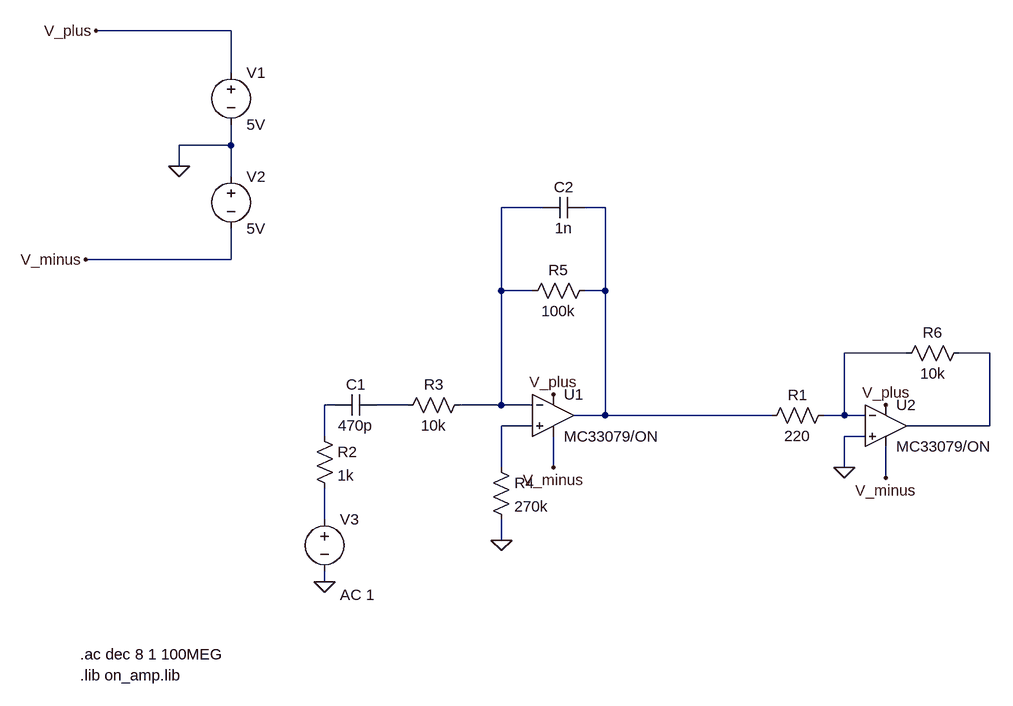
[diagram p0: schematic opamp_test.asc]
opamp_test.asc, the LTspice schematic file:
Version 4
SHEET 1 920 840
WIRE -1024 -448 -1232 -448
WIRE -1024 -384 -1024 -448
WIRE -1024 -272 -1024 -304
WIRE -1024 -272 -1104 -272
WIRE -1104 -240 -1104 -272
WIRE -1024 -224 -1024 -272
WIRE -544 -176 -608 -176
WIRE -448 -176 -480 -176
WIRE -1024 -96 -1024 -144
WIRE -1024 -96 -1248 -96
WIRE -608 -48 -608 -176
WIRE -560 -48 -608 -48
WIRE -448 -48 -448 -176
WIRE -448 -48 -480 -48
WIRE 16 48 -80 48
WIRE 144 48 96 48
WIRE -864 128 -880 128
WIRE -752 128 -800 128
WIRE -608 128 -608 -48
WIRE -608 128 -672 128
WIRE -560 128 -608 128
WIRE -448 144 -448 -48
WIRE -448 144 -496 144
WIRE -192 144 -448 144
WIRE -80 144 -80 48
WIRE -80 144 -112 144
WIRE -48 144 -80 144
WIRE -560 160 -608 160
WIRE 144 160 144 48
WIRE 144 160 16 160
WIRE -880 176 -880 128
WIRE -48 176 -80 176
WIRE -608 224 -608 160
WIRE -528 224 -528 176
WIRE -80 224 -80 176
WIRE -16 240 -16 192
WIRE -880 304 -880 256
WIRE -608 336 -608 304
WIRE -880 400 -880 384
FLAG -1104 -240 0
FLAG -1232 -448 V_plus
FLAG -1248 -96 V_minus
FLAG -528 224 V_minus
FLAG -528 112 V_plus
FLAG -880 400 0
FLAG -608 336 0
FLAG -16 240 V_minus
FLAG -16 128 V_plus
FLAG -80 224 0
SYMBOL Opamps\\opamp2 -528 80 R0
SYMATTR InstName U1
SYMATTR Value MC33079/ON
SYMBOL voltage -1024 -400 R0
WINDOW 123 0 0 Left 0
WINDOW 39 0 0 Left 0
SYMATTR InstName V1
SYMATTR Value 5V
SYMBOL voltage -1024 -240 R0
WINDOW 123 0 0 Left 0
WINDOW 39 0 0 Left 0
SYMATTR InstName V2
SYMATTR Value 5V
SYMBOL voltage -880 288 R0
WINDOW 123 24 132 Left 0
WINDOW 39 0 0 Left 0
SYMATTR Value2 AC 1
SYMATTR InstName V3
SYMATTR Value ""
SYMBOL res -896 160 R0
SYMATTR InstName R2
SYMATTR Value 1k
SYMBOL cap -800 112 R90
WINDOW 0 0 32 VBottom 0
WINDOW 3 32 32 VTop 0
SYMATTR InstName C1
SYMATTR Value 470p
SYMBOL res -656 112 R90
WINDOW 0 0 56 VBottom 0
WINDOW 3 32 56 VTop 0
SYMATTR InstName R3
SYMATTR Value 10k
SYMBOL res -624 208 R0
SYMATTR InstName R4
SYMATTR Value 270k
SYMBOL res -464 -64 R90
WINDOW 0 0 56 VBottom 0
WINDOW 3 32 56 VTop 0
SYMATTR InstName R5
SYMATTR Value 100k
SYMBOL res -96 128 R90
WINDOW 0 0 56 VBottom 0
WINDOW 3 32 56 VTop 0
SYMATTR InstName R1
SYMATTR Value 220
SYMBOL res 112 32 R90
WINDOW 0 0 56 VBottom 0
WINDOW 3 32 56 VTop 0
SYMATTR InstName R6
SYMATTR Value 10k
SYMBOL Opamps\\opamp2 -16 96 R0
SYMATTR InstName U2
SYMATTR Value MC33079/ON
SYMBOL cap -480 -192 R90
WINDOW 0 0 32 VBottom 0
WINDOW 3 32 32 VTop 0
SYMATTR InstName C2
SYMATTR Value 1n
TEXT -1256 544 Left 0 !.lib on_amp.lib
TEXT -1256 512 Left 0 !.ac dec 8 1 100MEG

The netlist it stands for:
* opamp_test.asc
XU1 N007 N001 V_plus V_minus N002 MC33079/ON  ; pins In+ In- V+ V- OUT
V1 V_plus 0 5V
V2 0 V_minus 5V
V3 N008 0 AC 1
R2 N005 N008 1k
C1 N006 N005 470p
R3 N001 N006 10k
R4 N007 0 270k
R5 N002 N001 100k
R1 N003 N002 220
R6 N004 N003 10k
XU2 0 N003 V_plus V_minus N004 MC33079/ON  ; pins In+ In- V+ V- OUT
C2 N002 N001 1n
.lib on_amp.lib
.ac dec 8 1 100MEG
.backanno
.end